# EAGLE schematic Battery_Monitor_ESP (EAGLE 9.0.1)
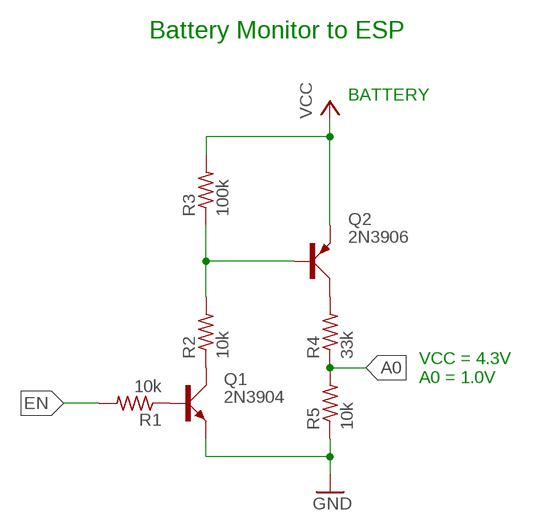
[diagram p0: schematic, sheet 1]

## Parts
Q1  2N3904  [TO92D]
Q2  2N3906  [TO92D]
R1  10k  R-US_0207/10  [0207/10]
R2  10k  R-US_0207/10  [0207/10]
R3  100k  R-US_0207/10  [0207/10]
R4  33k  R-US_0207/10  [0207/10]
R5  10k  R-US_0207/10  [0207/10]

## Nets
A0: R4.1 R5.2
EN: R1.2
GND: Q1.E R5.1
N$1: Q2.B R2.2 R3.1
N$2: Q1.C R2.1
N$4: Q2.C R4.2
N$5: Q1.B R1.1
VCC: Q2.E R3.2

## Notes on the sheet
- Battery Monitor to ESP
- BATTERY
- VCC = 4.3V
  A0 = 1.0V

## Library data of the parts
Q1 = transistor-small-signal:2N3904: NPN TRANSISTOR
Q2 = transistor-small-signal:2N3906: PNP TRANSISTOR
R1-R5 = rcl:R-US_: RESISTOR, American symbol; SPICEPREFIX: R